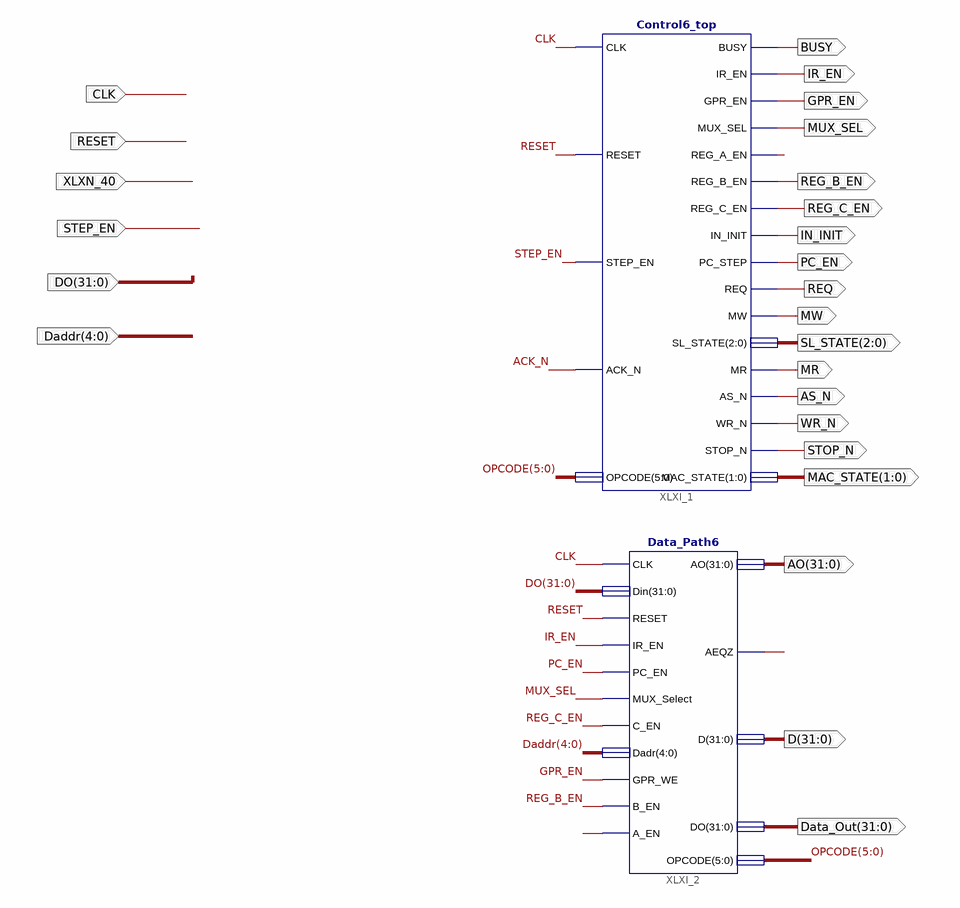
[diagram p0: schematic sheet 1]
// Xilinx ISE schematic SL_Machine_Top.sch (spartan6) as structural Verilog: 2 symbols, 26 ports
module SL_Machine_Top (
  input  RESET,
  input  STEP_EN,
  input  CLK,
  input  XLXN_40,
  input  ACK_N,
  input  [4:0] Daddr,
  input  [31:0] DO,
  output BUSY,
  output IR_EN,
  output REG_B_EN,
  output IN_INIT,
  output REQ,
  output MW,
  output [2:0] SL_STATE,
  output MR,
  output AS_N,
  output WR_N,
  output STOP_N,
  output [1:0] MAC_STATE,
  output PC_EN,
  output MUX_SEL,
  output REG_C_EN,
  output GPR_EN,
  output [31:0] AO,
  output [31:0] D,
  output [31:0] Data_Out
);

  wire XLXN_9, XLXN_33, XLXN_35;
  wire [5:0] OPCODE;

  Control6_top XLXI_1 (
    .CLK(CLK), .RESET(RESET), .STEP_EN(STEP_EN), .ACK_N(ACK_N), .OPCODE(OPCODE), .BUSY(BUSY), .IR_EN(IR_EN),
    .GPR_EN(GPR_EN), .MUX_SEL(MUX_SEL), .REG_A_EN(XLXN_9), .REG_B_EN(REG_B_EN), .REG_C_EN(REG_C_EN),
    .IN_INIT(IN_INIT), .PC_STEP(PC_EN), .REQ(REQ), .MW(MW), .SL_STATE(SL_STATE), .MR(MR), .AS_N(AS_N),
    .WR_N(WR_N), .STOP_N(STOP_N), .MAC_STATE(MAC_STATE));
  Data_Path6 XLXI_2 (
    .CLK(CLK), .Din(DO), .RESET(RESET), .IR_EN(IR_EN), .PC_EN(PC_EN), .MUX_Select(MUX_SEL), .C_EN(REG_C_EN),
    .Dadr(Daddr), .GPR_WE(GPR_EN), .B_EN(REG_B_EN), .A_EN(XLXN_33), .AO(AO), .AEQZ(XLXN_35), .D(D),
    .DO(Data_Out), .OPCODE(OPCODE));
endmodule
